# Altium project 12V_Horn.PrjPcb
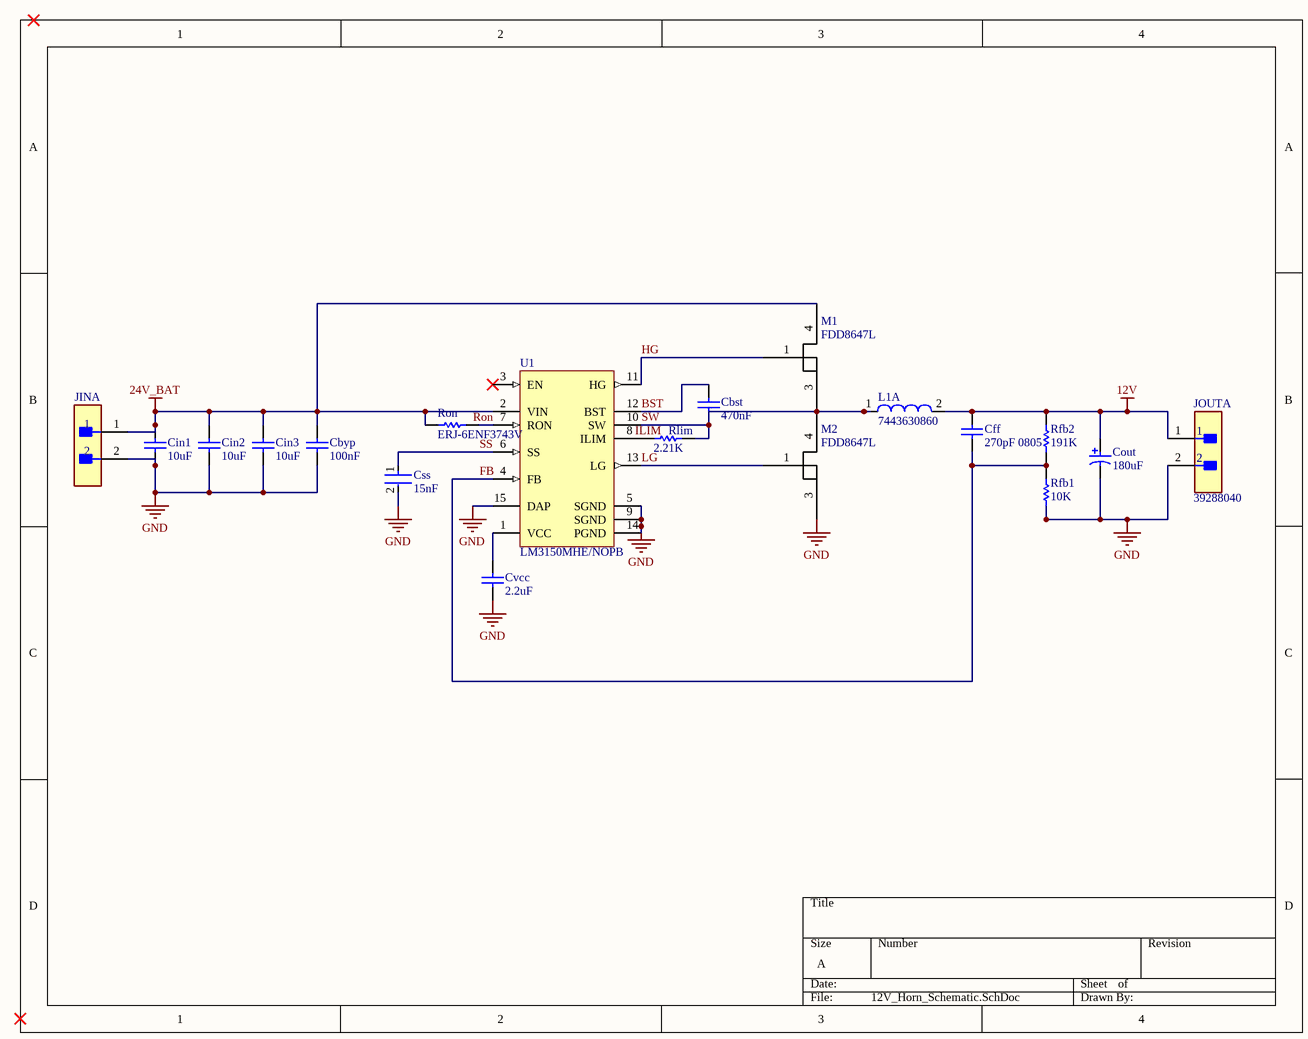
[diagram p0: 12V_Horn_Schematic.SchDoc]
1 sheet, 19 parts. Net scope: global (net labels, ports and power ports of the same name join across sheets).
Board file: 12V_Horn_PCB.PcbDoc

## Sheet 12V_Horn_Schematic.SchDoc: Horn: 12V
size A

### Parts
Cbst  470nF  [CAPC1608X90X35ML10T15]
Cbyp  100nF  [CAPC0805(2012)100_M]
Cff  270pF 0805  [CAPC0805(2012)75_M]
Cin1  10uF  [CAPC3225X270X30LL30]
Cin2  10uF  [CAPC3225X270X30LL30]
Cin3  10uF  [CAPC3225X270X30LL30]
Cout  180uF  [PNSC-SVP-F8_L]
Css  15nF  [FP-CGA4J-IPC_B]
Cvcc  2.2uF  [CAPC2013X135X50ML10T20]
JIN  39288040  [FP-39288040-MFG]  (value not drawn)  (part A of 2)
JOUT  39288040  [FP-39288040-MFG]  (part A of 2)
L1  7443630860  [WE-HCF-2013]  (part A of 2)
M1  FDD8647L  [FDD86471L]
M2  FDD8647L  [FDD86471L]
Rfb1  10K  [RESC2013X50X30NL20T20]
Rfb2  191K  [RESC2013X70X40ML20T20]
Rlim  2.21K  [RESC2013X50X30NL20T20]
Ron  ERJ-6ENF3743V  [RESC2013X70X40LL20T20]
U1  LM3150MHE/NOPB  [PWP0014A_L]

### Nets
12V: Cff.2 Cout.1 JOUT.1 L1.2 Rfb2.2
24V_BAT: Cbyp.2 Cin1.2 Cin2.2 Cin3.2 JIN.1 M1.4(D) Ron.1 U1.2(VIN)
GND: Cbyp.1 Cin1.1 Cin2.1 Cin3.1 Cout.2 Css.2 Cvcc.1 JIN.2 JOUT.2 M2.3(S) Rfb1.1 U1.5(SGND) U1.9(SGND) U1.14(PGND) U1.15(DAP)
BST: Cbst.2 U1.12(BST)
FB: Cff.1 Rfb1.2 Rfb2.1 U1.4(FB)
HG: M1.1(G) U1.11(HG)
LG: M2.1(G) U1.13(LG)
SS: Css.1 U1.6(SS)
SW: Cbst.1 L1.1 M1.3(S) M2.4(D) Rlim.2 U1.10(SW)
NetCvcc_2: Cvcc.2 U1.1(VCC)
NetRlim_1: Rlim.1 U1.8(ILIM)
NetRon_2: Ron.2 U1.7(RON)

Not connected (* = marked no-connect by the designer): U1 3(EN)*

### Notes on the sheet
- Labels drawn without touching a wire or pin: ILIM, Ron

### Library data of the parts
Cbst = CMP-2006-02798-1: Part Number: GRM188R60J474KA01D; Manufacturer: Murata
Cbyp = CMP-1036-04423-1: CAP 100nF 50V ±20% 0805 (2012 Metric) Thickness 1mm SMD; Case-Metric: 2012; Case-EIA: 0805; Tolerance: Â±20%; Technology: SMT; Rated Voltage: 50 V; Value: 100nF; Max Thickness: 1 mm
Cff = CMP-1036-02418-1: CAP 270pF 100V ±5% 0805 (2012 Metric) Thickness 0.75mm SMD; Tolerance: Â±5%; Case-EIA: 0805; Case-Metric: 2012; Technology: SMT; Max Thickness: 0.75 mm; Rated Voltage: 100 V; Value: 270pF
Cin1-Cin3 = CMP-2000-07458-1: Chip Capacitor, 10 uF, +/- 10%, 63 V, -55 to 125 degC, 1210 (3225 Metric), RoHS, Tape and Reel; Manufacturer: Murata; Dielectric: X7R; Voltage Rating: 63V; Case\/Package: 1210; Dielectric Material: Ceramic; Case Code (Imperial): 1210; Weight: 0.00388oz; Package Quantity: 1000; Min Operating Temperature: -55degC; Voltage: 63V; Datasheet URL: http://search.murata.co.jp/Ceramy/image/img/A01X/G101/ENG/GRM32ER71J106KA12-01.pdf; Capacitance: 10uF; Tolerance: 10%; Datasheet Version: 03/2016; Package Reference: 1210; Manufacturer URL: http://www.murata.com/; Package Description: 2-Pin Surface Mount Device, Body 3.2 x 2.5 mm; Height: 2.5mm; Length: 3.2mm; Max Operating Temperature: 125degC; REACH SVHC: NoSVHC; Lead Free: LeadFree; Case Code (Metric): 3225; Mounting Technology: SurfaceMount; Thickness: 0.106inch; Material: Ceramic; RoHSCompliant: true; Packaging: TapeandReel; Width: 2.5mm; Voltage Rating (DC): 63V; Depth: 2.5mm; Termination: SMD/SMT
Cout = CMP-2000-05493-1: Conductive Polymer Aluminum Solid Capacitor, 180 uF, +/- 20%, 16 V, -55 to 105 degC, 2-Pin SMD (F8), RoHS, Tape and Reel; Manufacturer: Panasonic; Voltage: 16VDC; ESR: 30mOhm; Product Height (mm): 7.9mm; Product Diameter (mm): 10mm; Ripple Current: 3.02A; Product Length (mm): NotRequiredmm; Lifetime: 2000hr; DCL: 576uA; Manufacturer URL: http://www.panasonic.com/; Mounting Technology: SurfaceMount; Package Description: 2-Pin Surface Mount Device, Body 10.3 x 10.3 mm; Packaging: TapeandReel; Construction: Cylindrical; Datasheet Version: 11/2015; Package Reference: SVP-F8; Lead Spacing (nom): NotRequiredmm; Datasheet URL: https://industrial.panasonic.com/cdbs/www-data/pdf/AAB8000/AAB8000C193.pdf; Mounting Style: SurfaceMount; Type: OS-CON; Capacitance: 180uF; Failure Rate: NotRequired; Product Depth (mm): NotRequiredmm; Tolerance (+ or -): 20%; Seated Plane Height: NotRequiredmm; Size (mm): 10X7.9mm; Operating Temp Range: -55Cto105C; Lead Diameter (nom): NotRequiredmm
Css = CMP-08246-000331-1: Cap Ceramic 15nF 50V C0G 5% Pad SMD 0805 +125°C Automotive T/R; Weight: 0.000194oz; Width: 0.049inch; Tolerance: 5%; REACH SVHC: No SVHC; Voltage Rating (DC): 50V; Case Code (Imperial): 0805; Depth: 1.25mm; Voltage Rating: 50V; Case Code (Metric): 2012; Thickness: 0.037inch; Height: 0.85mm; Max Operating Temperature: 125°C; Termination: SMD/SMT; Packaging: Tape and Reel; Mount: Surface Mount; Dielectric: C0G; Package Quantity: 1; Case/Package: 0805; Ratings: AEC-Q200; Capacitance: 15nF; Composition: Ceramic; Lead Free: Lead Free; Length: 2mm; Min Operating Temperature: -55°C
Cvcc = CMP-2007-03454-1: Part Number: GRM21BR71A225KA01L; Manufacturer: Murata
JIN JOUT = CMP-04776-000078-1: CONN HEADER VERT 4POS 4.2MM; Manufacturer: Molex; Number Of Contacts: 4; Conn Gender: Male; Voltage Rating: 600V; Current Rating: 9A; Conn Orientation: Vertical; Height: 13.1mm; RoHS: TRUE; Temperature Range High: +105°C; Manufacturer Part Number: 39288040; Contact Material: Tin,Nickel; Temperature: -40°C to +105°C; Number Of Rows: 2; ComponentLink2Description: Datasheet; Automotive: No; Pitch: 4.2mm; Device Class L1: Connectors; ComponentLink2URL: https://www.molex.com/webdocs/datasheets/pdf/en-us/0039288040_PCB_HEADERS.pdf; Octopart: https://octopart.com/39-28-8040-molex-25241; Footprint Url: https://www.molex.com/pdm_docs/sd/039288040_sd.pdf; Mouser Description: Conn Power HDR 4 POS 4.2mm Solder ST Thru-Hole 4 Terminal 1 Port Mini-Fit Jrá??Bag; Device Class L2: Headers and Wire Housings; Lead Free: Yes; Digikey Description: CONN HEADER VERT 4POS 4.2MM; Package: 0; Device Class L3: unset; Category: Conn; Temperature Range Low: -40°C
L1 = CMP-0226-00159-1: SMD High Current Inductor WE-HCF, L=8.60 µH; Inductance: 8.60 ÂµH; PackageReference: WE-HCF-2013; ComponentLink1Description: Manufacturer Link; ComponentLink2Description: Datasheet; DatasheetVersion: ver 1, Jul-2009; ComponentLink2URL: http://www.we-online.de/katalog/media/pdf/7443630860.pdf; ComponentLink1URL: http://www.we-online.com; PackageVersion: 2009; PackageDescription: SMD Inductor, 3-Leads, Body 21.5 x 21.0 mm
Rfb1 = CMP-2001-04908-1: Manufacturer: Vishay Dale; Part Number: CRCW080510K0FKEA
Rfb2 = CMP-2001-00021-1: Manufacturer: Panasonic; Part Number: ERJ-6ENF1913V
Rlim = CMP-2001-03763-1: Manufacturer: Vishay Dale; Part Number: CRCW08052K21FKEA
Ron = CMP-2001-00156-1: Manufacturer: Panasonic; Part Number: ERJ-6ENF3743V
U1 = CMP-0069-01799-3: SIMPLE SWITCHER® CONTROLLER, 42V Synchronous Step-Down, 14-pin TSSOP-EP, Pb-Free; Manufacturer: Texas Instruments; PackageTopMarking: NSUZXYTT*LM3150*MH; PowerWise: Y; ComponentLink1URL: http://www.ti.com/general/docs/lit/getliterature.tsp?genericPartNumber=LM3150&fileType=pdf; PinCount: 14; RoHS: Y; PackageDescription: Molded TSSOP, JEDEC, Exposed Pad, 5.0 x 4.4 x 0.9mm Body, 14 Lead, 0.65mm Pitch; ComponentLink1Description: Datasheet URL; CompType: Switcher; PackageReference: PWP0014A; Code_JEDEC: MO-153-ABT-1